# Altium schematic sheet RowDotMatrix.SchDoc
size A4
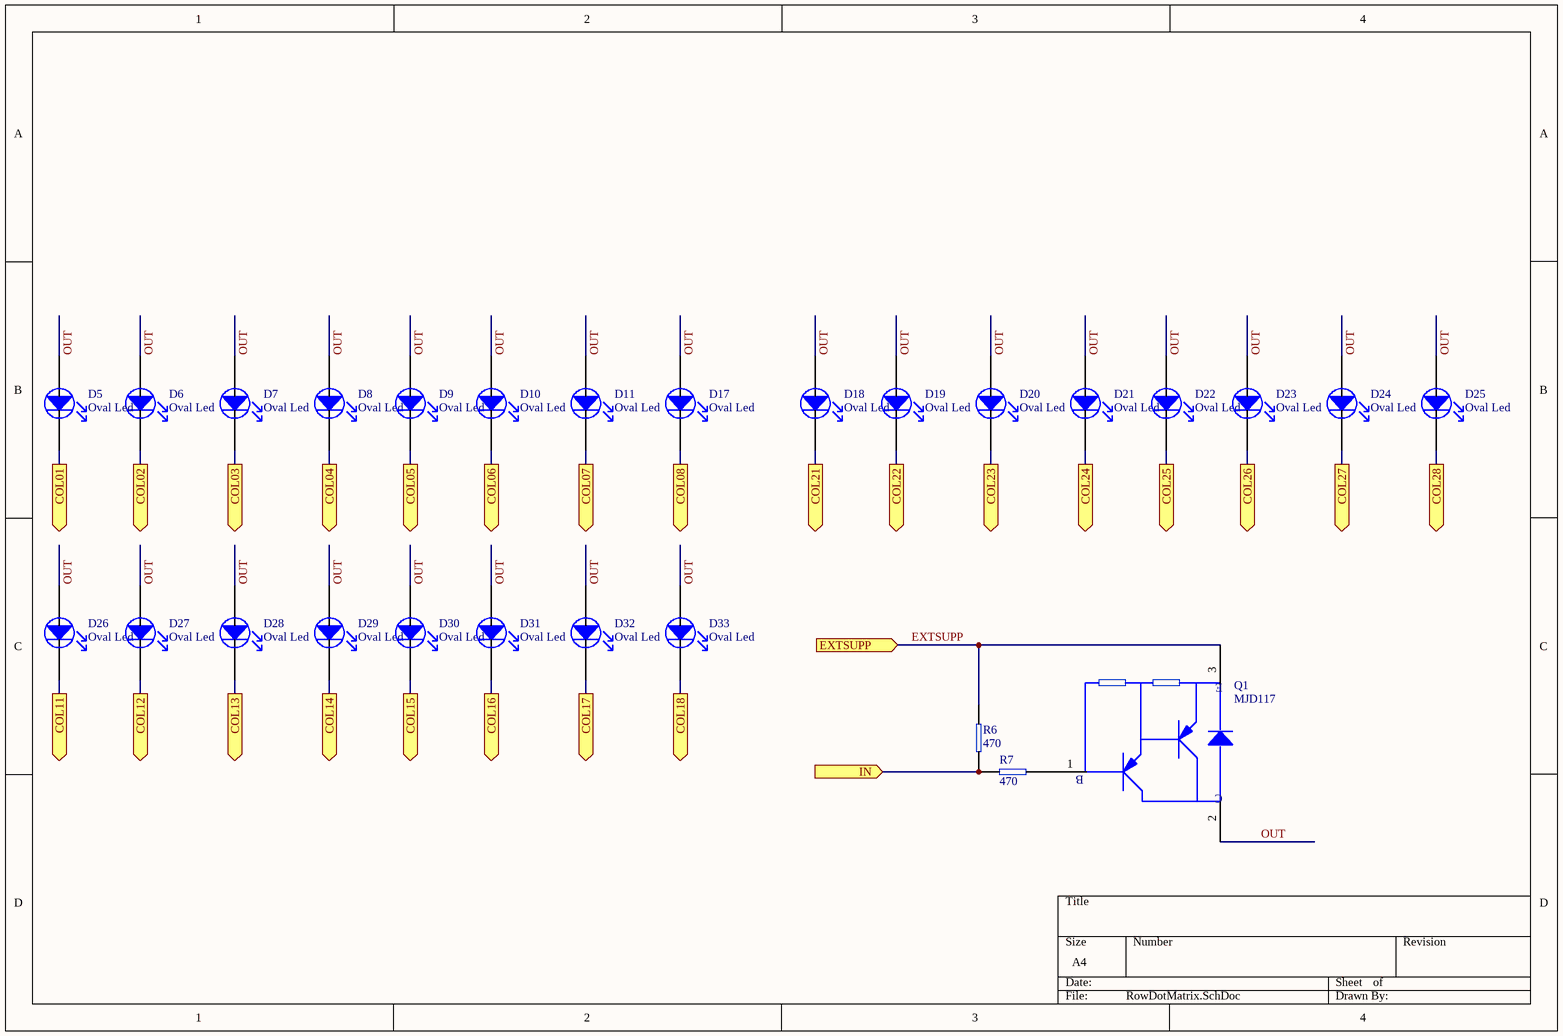
[diagram p0: RowDotMatrix.SchDoc]

## Parts
D5  Oval Led  [LED]
D6  Oval Led  [LED]
D7  Oval Led  [LED]
D8  Oval Led  [LED]
D9  Oval Led  [LED]
D10  Oval Led  [LED]
D11  Oval Led  [LED]
D17  Oval Led  [LED]
D18  Oval Led  [LED]
D19  Oval Led  [LED]
D20  Oval Led  [LED]
D21  Oval Led  [LED]
D22  Oval Led  [LED]
D23  Oval Led  [LED]
D24  Oval Led  [LED]
D25  Oval Led  [LED]
D26  Oval Led  [LED]
D27  Oval Led  [LED]
D28  Oval Led  [LED]
D29  Oval Led  [LED]
D30  Oval Led  [LED]
D31  Oval Led  [LED]
D32  Oval Led  [LED]
D33  Oval Led  [LED]
Q1  MJD117  [MJD117]
R6  value 470  [RES2512]  (hidden comment: RES470)
R7  value 470  [RES2512]  (hidden comment: RES470)

## Ports
COL01 (out), COL02 (out), COL03 (out), COL04 (out), COL05 (out), COL06 (out), COL07 (out), COL08 (out), COL11 (out), COL12 (out), COL13 (out), COL14 (out), COL15 (out), COL16 (out), COL17 (out), COL18 (out), COL21 (out), COL22 (out), COL23 (out), COL24 (out), COL25 (out), COL26 (out), COL27 (out), COL28 (out), EXTSUPP (in), IN (in)

## Nets
COL01: D5.K(Cathode) ; port COL01
COL02: D6.K(Cathode) ; port COL02
COL03: D7.K(Cathode) ; port COL03
COL04: D8.K(Cathode) ; port COL04
COL05: D9.K(Cathode) ; port COL05
COL06: D10.K(Cathode) ; port COL06
COL07: D11.K(Cathode) ; port COL07
COL08: D17.K(Cathode) ; port COL08
COL11: D26.K(Cathode) ; port COL11
COL12: D27.K(Cathode) ; port COL12
COL13: D28.K(Cathode) ; port COL13
COL14: D29.K(Cathode) ; port COL14
COL15: D30.K(Cathode) ; port COL15
COL16: D31.K(Cathode) ; port COL16
COL17: D32.K(Cathode) ; port COL17
COL18: D33.K(Cathode) ; port COL18
COL21: D18.K(Cathode) ; port COL21
COL22: D19.K(Cathode) ; port COL22
COL23: D20.K(Cathode) ; port COL23
COL24: D21.K(Cathode) ; port COL24
COL25: D22.K(Cathode) ; port COL25
COL26: D23.K(Cathode) ; port COL26
COL27: D24.K(Cathode) ; port COL27
COL28: D25.K(Cathode) ; port COL28
EXTSUPP: Q1.3(E) R6.1(pos) ; port EXTSUPP
IN: R6.2(neg) R7.1(pos) ; port IN
OUT: D5.A(Anode) D6.A(Anode) D7.A(Anode) D8.A(Anode) D9.A(Anode) D10.A(Anode) D11.A(Anode) D17.A(Anode) D18.A(Anode) D19.A(Anode) D20.A(Anode) D21.A(Anode) D22.A(Anode) D23.A(Anode) D24.A(Anode) D25.A(Anode) D26.A(Anode) D27.A(Anode) D28.A(Anode) D29.A(Anode) D30.A(Anode) D31.A(Anode) D32.A(Anode) D33.A(Anode) Q1.2(C)
NetQ1_1: Q1.1(B) R7.2(neg)

## Library data of the parts
D5-D11 D17-D33 = Oval Led: LED estándar - Montaje interfacial Red Oval LED; MPN: C566C-RFN-CV0W0BB2; Value: 2200 mcd 70x35 deg; Supplier: Mouser; Supplier PN: 941-C566CRFNCV0W0BB2
Q1 = MJD117: Transistores Darlington PNP Silicon Darl; MPN: MJD117TF; Value: PNP; Supplier: Mouser; Supplier PN: 512-MJD117TF
R6 R7 = RES470: Resistores de película gruesa - SMD 1watt 470ohms 5%; MPN: CRCW2512470RJNEG; Supplier: Mouser; Supplier PN: 71-CRCW2512J-470-E3